# EAGLE design releBoard_v10 (EAGLE 6.2)
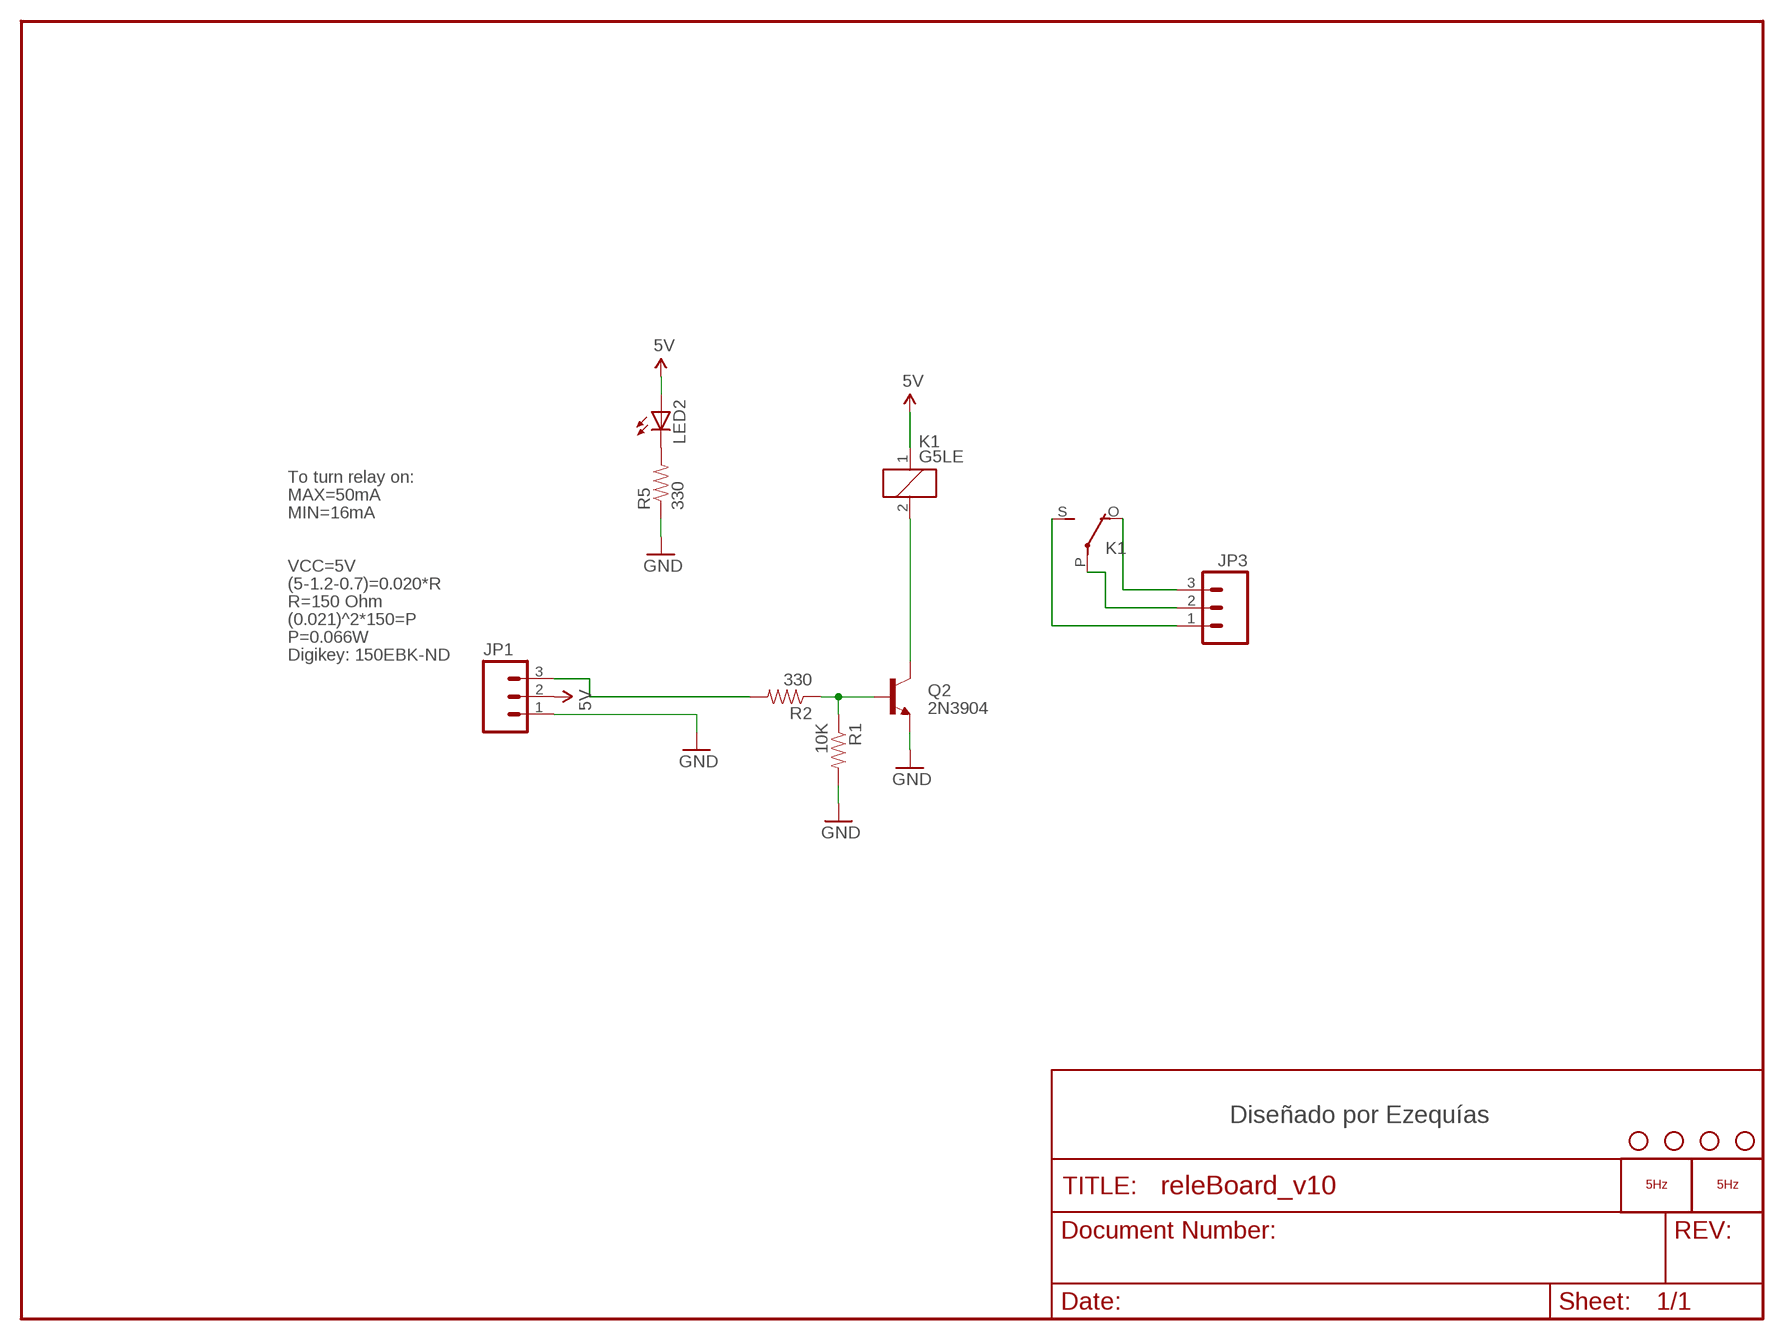
[diagram p0: schematic, sheet 1]

## Parts
JP1  M03POLAR  [MOLEX-1X3]
JP3  M03-SCREW-5MM  [SCREWTERMINAL-5MM-3]
K1  G5LE  [G5LE]
LED2  LED0603  [LED-0603]
LOGO1  LOGO_5HZ_H_15MM  [5HZ_LOGO_H_15MM]
LOGO2  LOGO_5HZ_WEB_COOPER_10MM  [5HZ_WEB_COOPER_10MM]
Q2  2N3904  TRANSISTOR_NPNSOT23  [SOT23]
R1  10K  RESISTOR0603-RES  [0603-RES]
R2  330  RESISTOR0603-RES  [0603-RES]
R5  330  RESISTOR0603-RES  [0603-RES]
U$3  STAND-OFF  [STAND-OFF]
U$4  STAND-OFF  [STAND-OFF]
U$5  STAND-OFF  [STAND-OFF]
U$7  STAND-OFF  [STAND-OFF]

## Nets
5V: JP1.2 K1.1 LED2.A
COIL: K1.2 Q2.3(C)
GND: JP1.1 Q2.2(E) R1.2 R5.1
LINE: JP3.2 K1.P(2:P)
N$1: JP1.3 R2.2
N$4: LED2.C R5.2
N$6: Q2.1(B) R1.1 R2.1
NC: JP3.3 K1.O(2:O)
NO: JP3.1 K1.S(2:S)

## Notes on the sheet
- To turn relay on:
- MAX=50mA
- MIN=16mA
- VCC=5V
- (5-1.2-0.7)=0.020*R
- R=150 Ohm
- (0.021)^2*150=P
- P=0.066W
- Digikey: 150EBK-ND
- Diseñado por Ezequías

## Library data of the parts
JP1 JP3 = SparkFun:M03: Header 3 Standard 3-pin 0.1" header. Use with straight break away headers (SKU : PRT-00116), right angle break away headers (PRT-00553), swiss pins (PRT-00743), machine pins (PRT-00117), and female headers (PRT-00115). Molex polarized connector foot print use with SKU : PRT-08232 with associated crimp pins and housings.
K1 = relay:G5LE: RELAY 1 x switch, 10 A/120 V AC, 8 A/30 V DC, Omron; OC_FARNELL: unknown; OC_NEWARK: unknown
LED2 = SparkFun:LED: LEDs Standard schematic elements and footprints for 5mm, 3mm, 1206, and 0603 sized LEDs. 5mm - Spark Fun Electronics SKU : COM-00529 (and others)
LOGO1 LOGO2 = 5hz-electronica:LOGO_5HZ: Logotipo 5Hz "según Pedro"
Q2 = SparkFun:TRANSISTOR_NPN: Transistor NPN BJT configuration in SOT23 package. MMBT2222 is the common NPN we use. Double check BCE configuration again layout.
R1 R2 R5 = SparkFun:RESISTOR: Resistor Basic schematic elements and footprints for 0603, 1206, and PTH resistors.
U$3-U$5 U$7 = SparkFun:STAND-OFF: Stand Off This is the mechanical footprint for a #4 phillips button head screw. Use the keepout ring to avoid running the screw head into surrounding components. SKU : PRT-00447

## Board
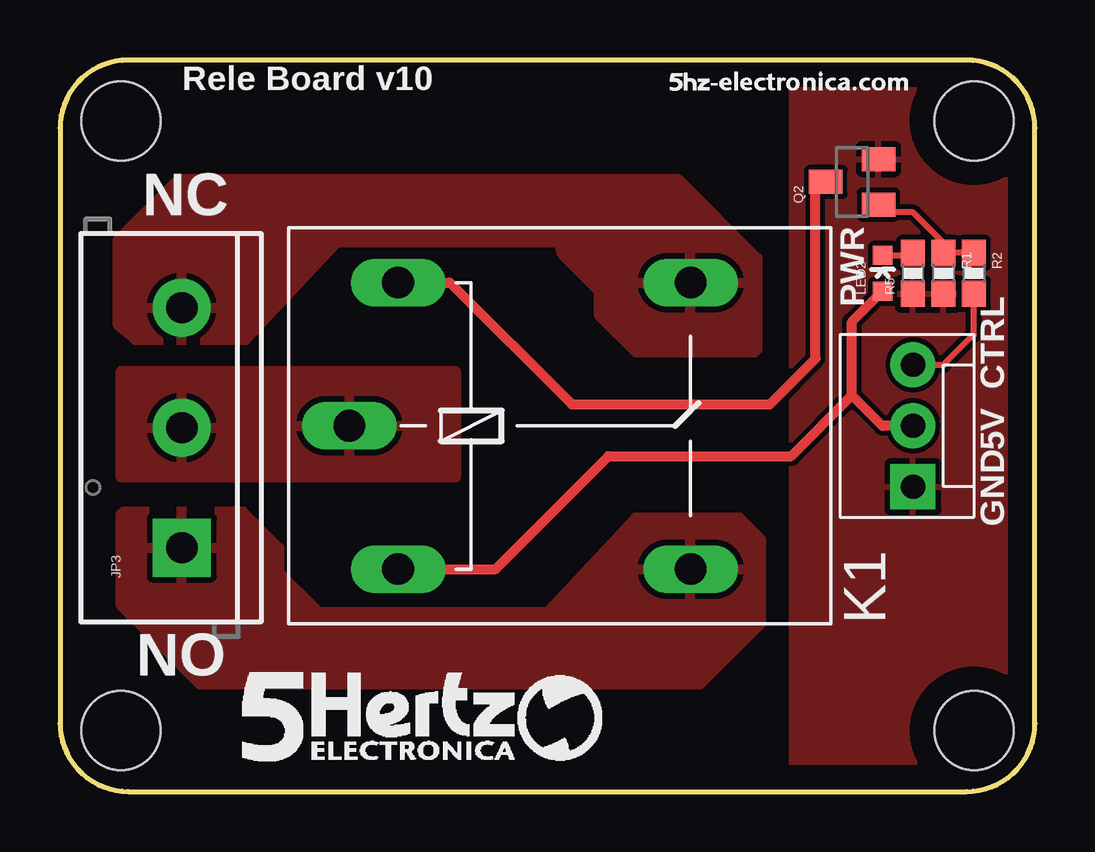
[diagram p1: board, top side]
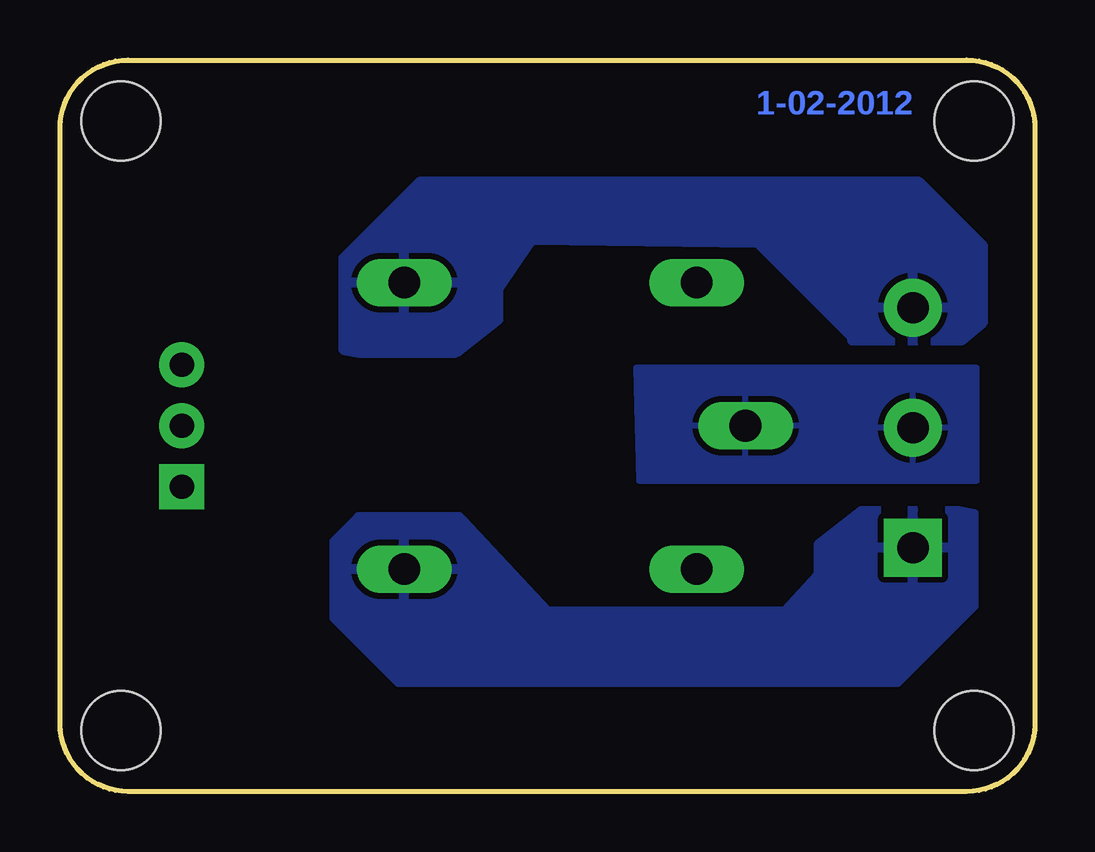
[diagram p2: board, bottom side, seen from below]

Size 40.64 x 30.48 mm. Coordinates in mm from the lower left corner, seen from the top.
Outline: 37.8,0 arc90 40.64,2.84 40.64,27.64 arc90 37.8,30.48 2.84,30.48 arc90 0,27.64 0,2.84 arc90 2.84,0 37.8,0
Copper layers (1*16): Top 0.035mm / dielectric 1.5mm / Bottom 0.035mm
Design rules: minimum track width 10mil, minimum drill 24mil, track to track 8mil, track to pad 8mil, pad to pad 8mil, via to via 8mil, smd to smd 8mil, copper to edge 40mil, drill to drill 8mil, minimum pad ring 10mil, minimum via ring 8mil, stop-mask expansion 4mil, vias tented up to drill 0mil, thermal gap 10mil

### Footprints (pad centres in the part's own frame; a part is rotated, then mirrored left to right if it is on the bottom)
MOLEX-1X3 = drill 1.016 pad 1.88 square: 1 0,0 | drill 1.016 pad 1.88: 2 2.54,0; 3 5.08,0
SCREWTERMINAL-5MM-3 = drill 1.3 pad 2.413 square: 1 0,0 | drill 1.3 pad 2.413: 2 5,0; 3 10,0
G5LE = drill 1.321 long: 1 -7.493,-5.969; 2 -7.493,5.969; O 4.699,5.969; P -9.525,0; S 4.699,-5.969
LED-0603 = smd 0.8 x 0.8: A 0,-0.75; C 0,0.75
SOT23 = smd 1 x 1.4: 1 -0.95,-1.1; 2 0.95,-1.1; 3 0,1.1
0603-RES = smd 1.1 x 1: 1 -0.85,0; 2 0.85,0
STAND-OFF = hole 3.302: 0,0

### Placement (x,y rotation side)
JP1  35.56,12.7 90 top
JP3  5.08,10.16 90 top
K1  21.59,15.24 0 top
LED2  34.29,21.59 0 top
LOGO1  7.62,1.27 0 top
LOGO2  25.4,29.21 0 top
Q2  33.02,25.4 90 top
R1  36.83,21.59 270 top
R2  38.1,21.59 270 top
R5  35.56,21.59 90 top
U$3  2.54,2.54 0 top
U$4  38.1,27.94 0 top
U$5  2.54,27.94 0 top
U$7  38.1,2.54 0 top

### Tracks (layer width: path | path; a pad name or v marks a point on that pad's centre or on a via)
5V
  Top 0.406: JP1.2 34.29,15.24 33.02,16.51 | 33.02,16.51 33.02,19.57 LED2.A | K1.1 18.16,9.27 22.86,13.97 30.48,13.97 33.02,16.51
COIL
  Top 0.406: K1.2 16.26,21.21 21.34,16.13 29.59,16.13 31.5,18.03 31.5,24.98 Q2.3
GND
  pour Top: 30.48,0 30.48,30.48 38.1,30.48 arc-90 40.64,27.94 40.64,2.54 arc-90 38.1,0
LINE
  pour Top: 2.54,17.53 16.51,17.53 16.51,13.08 2.54,13.08
  pour Bottom: 2.41,17.65 16.64,17.65 16.51,12.95 2.41,12.95
N$1
  Top 0.254: JP1.3 36.83,17.78 38.1,19.05 R2.2
N$4
  Top 0.254: LED2.C 35.46,22.34 R5.2
N$6
  Top 0.254: R2.1 R1.1 36.83,22.86 35.56,24.13 34.44,24.13 Q2.1
NC
  pour Top: 20.83,22.86 11.56,22.86 7.75,18.8 3.17,18.8 2.41,19.43 2.41,22.99 4.95,25.53 25.78,25.53 29.08,22.23 29.08,18.41 28.96,18.29 24,18.29 22.48,19.81 22.48,20.83 20.95,22.35
  pour Bottom: 7.62,18.8 3.05,18.8 2.16,19.56 2.16,22.73 4.83,25.4 25.65,25.4 28.83,22.23 28.83,18.41 28.19,18.29 24.13,18.29 22.35,19.68 22.35,20.95 20.95,22.99 11.56,22.86 7.62,18.92 7.49,18.92
NO
  pour Bottom: 24,11.43 28.19,11.43 29.21,10.41 29.21,7.24 26.54,4.57 5.71,4.57 2.54,7.75 2.54,11.56 3.17,11.68 7.24,11.68 9.02,10.29 9.02,9.02 10.41,7.49 20.32,7.49 23.88,11.3 24,11.3
  pour Top: 10.67,7.49 20.32,7.49 24,11.43 28.32,11.43 29.21,10.54 29.21,6.99 26.67,4.45 5.84,4.45 2.54,7.75 2.54,11.56 2.67,11.68 7.62,11.68 9.14,10.16 9.14,9.14 10.67,7.62

### Text on the board
Bottom: 1-02-2012
tPlace: Rele Board v10 | NC | PWR | CTRL | 5V | GND | NO